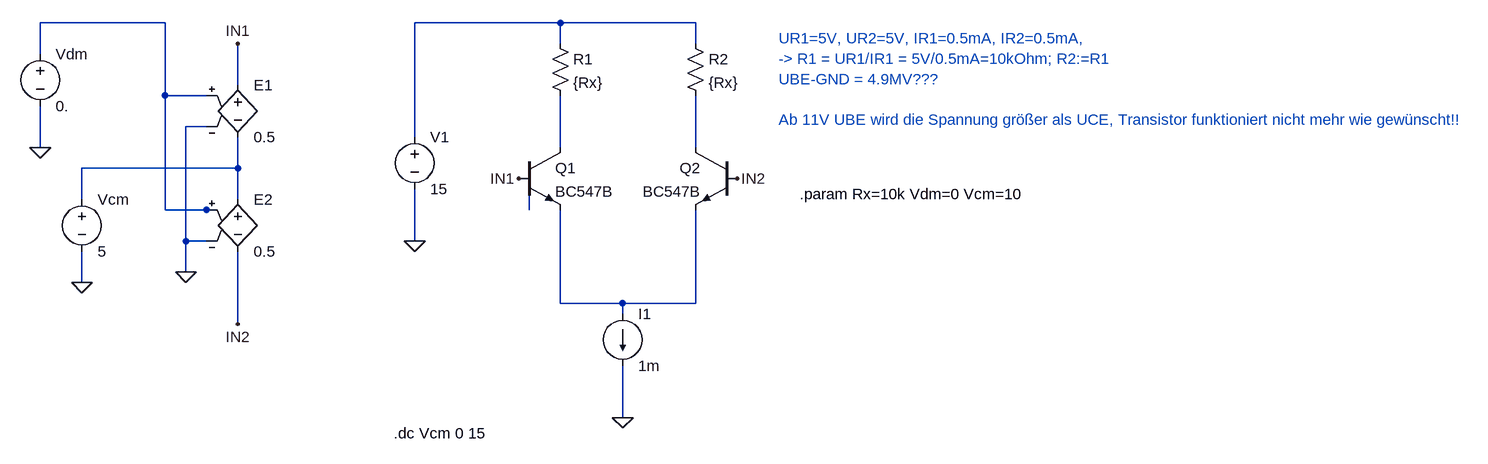
[diagram p0: schematic LaboruebungDiffVerstaerkerIdealSweep.asc]
LaboruebungDiffVerstaerkerIdealSweep.asc, the LTspice schematic file:
Version 4
SHEET 1 1624 680
WIRE -464 -256 -656 -256
WIRE 144 -256 -80 -256
WIRE 352 -256 144 -256
WIRE 144 -224 144 -256
WIRE 352 -224 352 -256
WIRE -656 -208 -656 -256
WIRE -352 -160 -352 -224
WIRE -464 -144 -464 -256
WIRE -400 -144 -464 -144
WIRE -400 -96 -432 -96
WIRE -80 -80 -80 -256
WIRE -656 -64 -656 -128
WIRE 144 -64 144 -144
WIRE 352 -64 352 -144
WIRE -352 -32 -352 -80
WIRE -352 -32 -592 -32
WIRE -592 16 -592 -32
WIRE -352 16 -352 -32
WIRE -464 32 -464 -144
WIRE -400 32 -464 32
WIRE -384 32 -400 32
WIRE 96 32 96 -16
WIRE -432 80 -432 -96
WIRE -400 80 -432 80
WIRE -80 80 -80 0
WIRE -432 128 -432 80
WIRE -592 144 -592 96
WIRE 144 176 144 32
WIRE 240 176 144 176
WIRE 352 176 352 32
WIRE 352 176 240 176
WIRE 240 192 240 176
WIRE -352 208 -352 96
WIRE 240 352 240 272
FLAG 240 352 0
FLAG -80 80 0
FLAG 80 -16 IN1
FLAG 416 -16 IN2
FLAG -352 208 IN2
FLAG -432 128 0
FLAG -592 144 0
FLAG -656 -64 0
FLAG -352 -224 IN1
SYMBOL current 240 192 R0
WINDOW 123 0 0 Left 0
WINDOW 39 0 0 Left 0
SYMATTR InstName I1
SYMATTR Value 1m
SYMBOL voltage -80 -96 R0
WINDOW 123 0 0 Left 0
WINDOW 39 0 0 Left 0
SYMATTR InstName V1
SYMATTR Value 15
SYMBOL npn 80 -64 R0
SYMATTR InstName Q1
SYMATTR Value BC547B
SYMBOL npn 416 -64 M0
SYMATTR InstName Q2
SYMATTR Value BC547B
SYMBOL res 128 -240 R0
SYMATTR InstName R1
SYMATTR Value {Rx}
SYMBOL res 336 -240 R0
SYMATTR InstName R2
SYMATTR Value {Rx}
SYMBOL e -352 -176 R0
SYMATTR InstName E1
SYMATTR Value 0.5
SYMBOL e -352 0 R0
SYMATTR InstName E2
SYMATTR Value 0.5
SYMBOL voltage -656 -224 R0
WINDOW 123 0 0 Left 0
WINDOW 39 0 0 Left 0
SYMATTR InstName Vdm
SYMATTR Value 0.
SYMBOL voltage -592 0 R0
WINDOW 123 0 0 Left 0
WINDOW 39 0 0 Left 0
SYMATTR InstName Vcm
SYMATTR Value 5
TEXT -112 376 Left 2 !.dc Vcm 0 15
TEXT 480 -232 Left 2 ;UR1=5V, UR2=5V, IR1=0.5mA, IR2=0.5mA, \n-> R1 = UR1/IR1 = 5V/0.5mA=10kOhm; R2:=R1\nUBE-GND = 4.9MV???\n \nAb 11V UBE wird die Spannung größer als UCE, Transistor funktioniert nicht mehr wie gewünscht!!
TEXT 512 8 Left 2 !.param Rx=10k Vdm=0 Vcm=10

The netlist it stands for:
* LaboruebungDiffVerstaerkerIdealSweep.asc
I1 N007 0 1m
V1 N002 0 15
Q1 N003 IN1 N007 0 BC547B
Q2 N004 IN2 N007 0 BC547B
R1 N002 N003 {Rx}
R2 N002 N004 {Rx}
E1 IN1 N005 N001 0 0.5
E2 N005 IN2 N001 0 0.5
Vdm N001 0 0.
Vcm N005 0 5
.model NPN NPN
.model PNP PNP
.lib standard.bjt
.dc Vcm 0 15
* UR1=5V, UR2=5V, IR1=0.5mA, IR2=0.5mA,
* -> R1 = UR1/IR1 = 5V/0.5mA=10kOhm; R2:=R1
* UBE-GND = 4.9MV???
* Ab 11V UBE wird die Spannung größer als UCE, Transistor funktioniert nicht mehr wie gewünscht!!
.param Rx=10k Vdm=0 Vcm=10
.backanno
.end